# EAGLE design PWRBRD_2 (EAGLE 5.06)
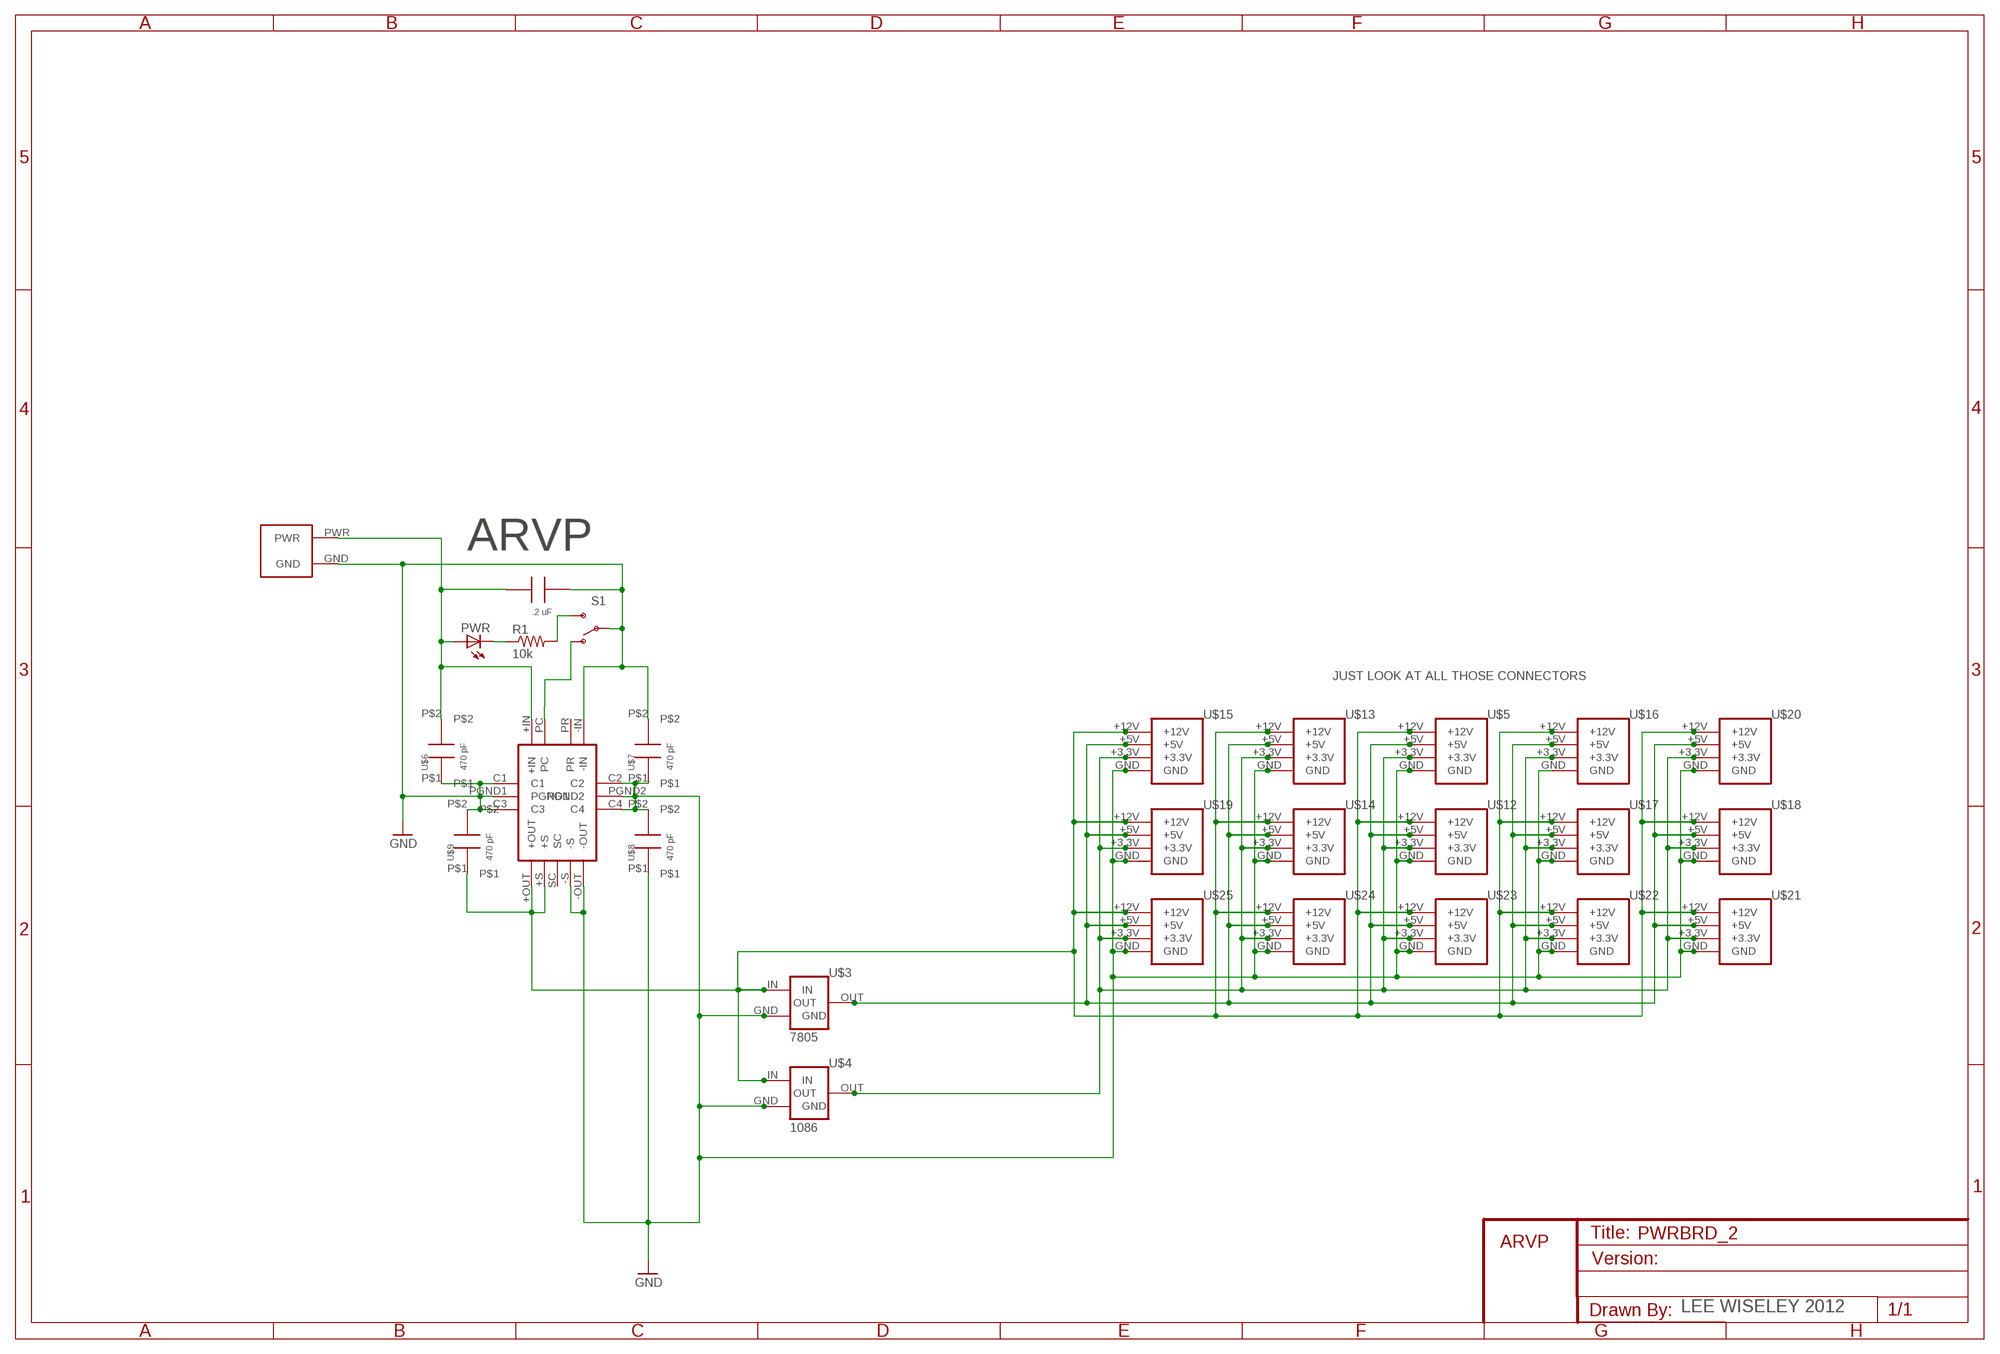
[diagram p0: schematic, sheet 1]

## Parts
BATTERY1  AND_PWR  [AND_PWR]
PWR  LED5MM  [LED5MM]
R1  10k  R-US_0207/7  [0207/7]
S1  SWITCH-SPSTPTH  [SWITCH-SPDT]
U$1  V24A12E400BG  [V24A12C400BL_VICOR_24_12_DC_STEPDOWN]
U$2  NAME  [NAME]
U$3  7805  [7805]
U$4  1086  [1086]
U$5  MINIFIT  [MINIFIT]
U$6  CS85_B2GA471KYS_470PF_CAP  [CS85-B2GA471KYS_470PF_CAP]
U$7  CS85_B2GA471KYS_470PF_CAP  [CS85-B2GA471KYS_470PF_CAP]
U$8  CS85_B2GA471KYS_470PF_CAP  [CS85-B2GA471KYS_470PF_CAP]
U$9  CS85_B2GA471KYS_470PF_CAP  [CS85-B2GA471KYS_470PF_CAP]
U$10  ECW-F4204JL_.2UF_CAP  [ECW-F4204JL_.2UF_CAP]
U$11  ARVP_LOGO  [ARVP]
U$12  MINIFIT  [MINIFIT]
U$13  MINIFIT  [MINIFIT]
U$14  MINIFIT  [MINIFIT]
U$15  MINIFIT  [MINIFIT]
U$16  MINIFIT  [MINIFIT]
U$17  MINIFIT  [MINIFIT]
U$18  MINIFIT  [MINIFIT]
U$19  MINIFIT  [MINIFIT]
U$20  MINIFIT  [MINIFIT]
U$21  MINIFIT  [MINIFIT]
U$22  MINIFIT  [MINIFIT]
U$23  MINIFIT  [MINIFIT]
U$24  MINIFIT  [MINIFIT]
U$25  MINIFIT  [MINIFIT]
U$26  BIG_ARVP  [BIG_ARVP]

## Nets
GND: BATTERY1.GND S1.2(P) U$1.-IN U$1.-OUT U$1.-S U$1.C1 U$1.C2 U$1.C3 U$1.C4 U$1.PGND1 U$1.PGND2 U$3.GND U$4.GND U$5.GND U$6.P$1 U$7.P$1 U$7.P$2 U$8.P$1 U$8.P$2 U$9.P$2 U$10.P$1 U$12.GND U$13.GND U$14.GND U$15.GND U$16.GND U$17.GND U$18.GND U$19.GND U$20.GND U$21.GND U$22.GND U$23.GND U$24.GND U$25.GND
N$1: U$4.OUT U$5.+3.3V U$12.+3.3V U$13.+3.3V U$14.+3.3V U$15.+3.3V U$16.+3.3V U$17.+3.3V U$18.+3.3V U$19.+3.3V U$20.+3.3V U$21.+3.3V U$22.+3.3V U$23.+3.3V U$24.+3.3V U$25.+3.3V
N$2: BATTERY1.PWR PWR.A U$1.+IN U$6.P$2 U$10.P$2
N$3: PWR.K(C) R1.1
N$4: S1.1(O) U$1.PC
N$5: R1.2 S1.3(S)
N$6: U$1.+OUT U$1.+S U$3.IN U$4.IN U$5.+12V U$9.P$1 U$12.+12V U$13.+12V U$14.+12V U$15.+12V U$16.+12V U$17.+12V U$18.+12V U$19.+12V U$20.+12V U$21.+12V U$22.+12V U$23.+12V U$24.+12V U$25.+12V
N$8: U$3.OUT U$5.+5V U$12.+5V U$13.+5V U$14.+5V U$15.+5V U$16.+5V U$17.+5V U$18.+5V U$19.+5V U$20.+5V U$21.+5V U$22.+5V U$23.+5V U$24.+5V U$25.+5V
Unconnected: U$1.PR U$1.SC

## Notes on the sheet
- JUST LOOK AT ALL THOSE CONNECTORS

## Library data of the parts
BATTERY1 = ARVP2:AND_PWR
PWR = SparkFun:LED: LEDs Standard schematic elements and footprints for 5mm, 3mm, 1206, and 0603 sized LEDs. 5mm - Spark Fun Electronics SKU : COM-00529 (and others)
R1 = rcl:R-US_: RESISTOR, American symbol
S1 = ARVP:SWITCH-SPST: SPST Switch Simple slide switch. Spark Fun Electronics SKU : COM-00102
U$1 = Kris:V24A12E400BG: VICOR Power V24A12E400BG 24-12 V DC-DC Switching Converter Converts a range of voltages around 24 V to 12 V with up to 400 W of output power.
U$2 = Kris:NAME
U$3 = Kris:7805
U$4 = Kris:1086
U$5 U$12-U$25 = Kris:MINIFIT: Molex Minifit Connector Versatile 4-contact power connector.
U$6-U$9 = Kris:CS85_B2GA471KYS_470PF_CAP
U$10 = Kris:ECW-F4204JL_.2UF_CAP: PANASONIC ECW-F4204JL .2uF Capacitor
U$11 = ARVP2:ARVP_LOGO
U$26 = Kris:BIG_ARVP

## Board
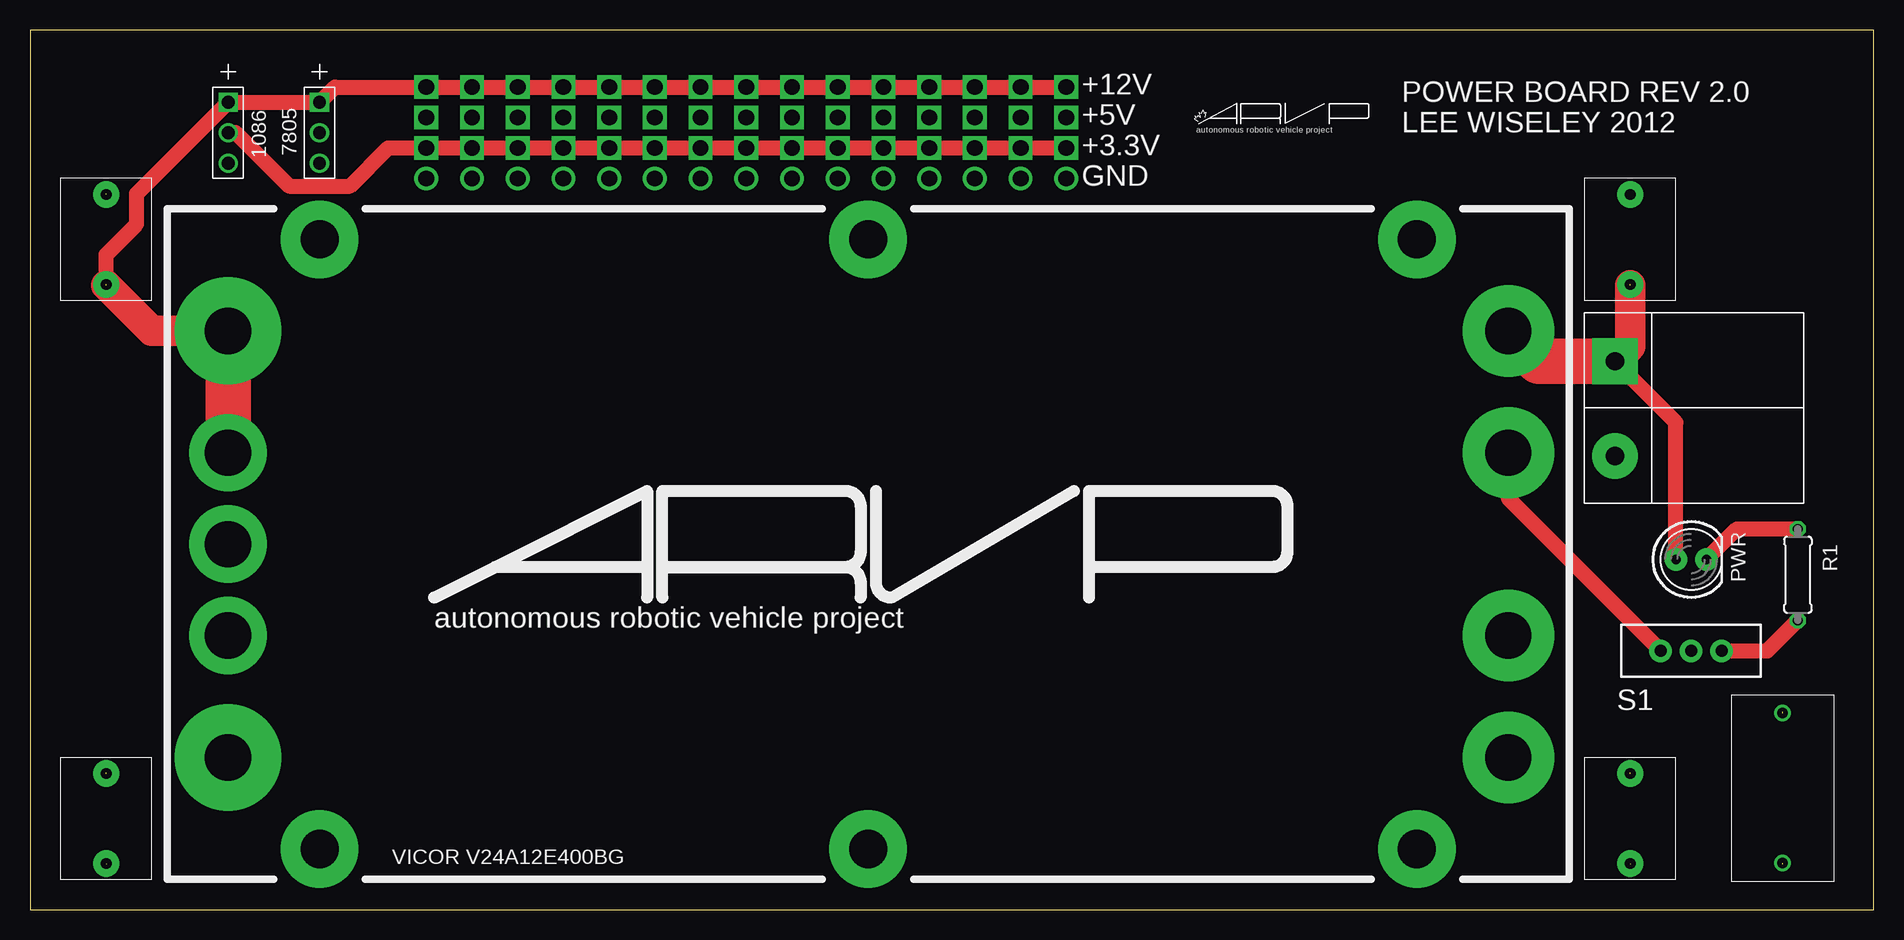
[diagram p1: board, top side]
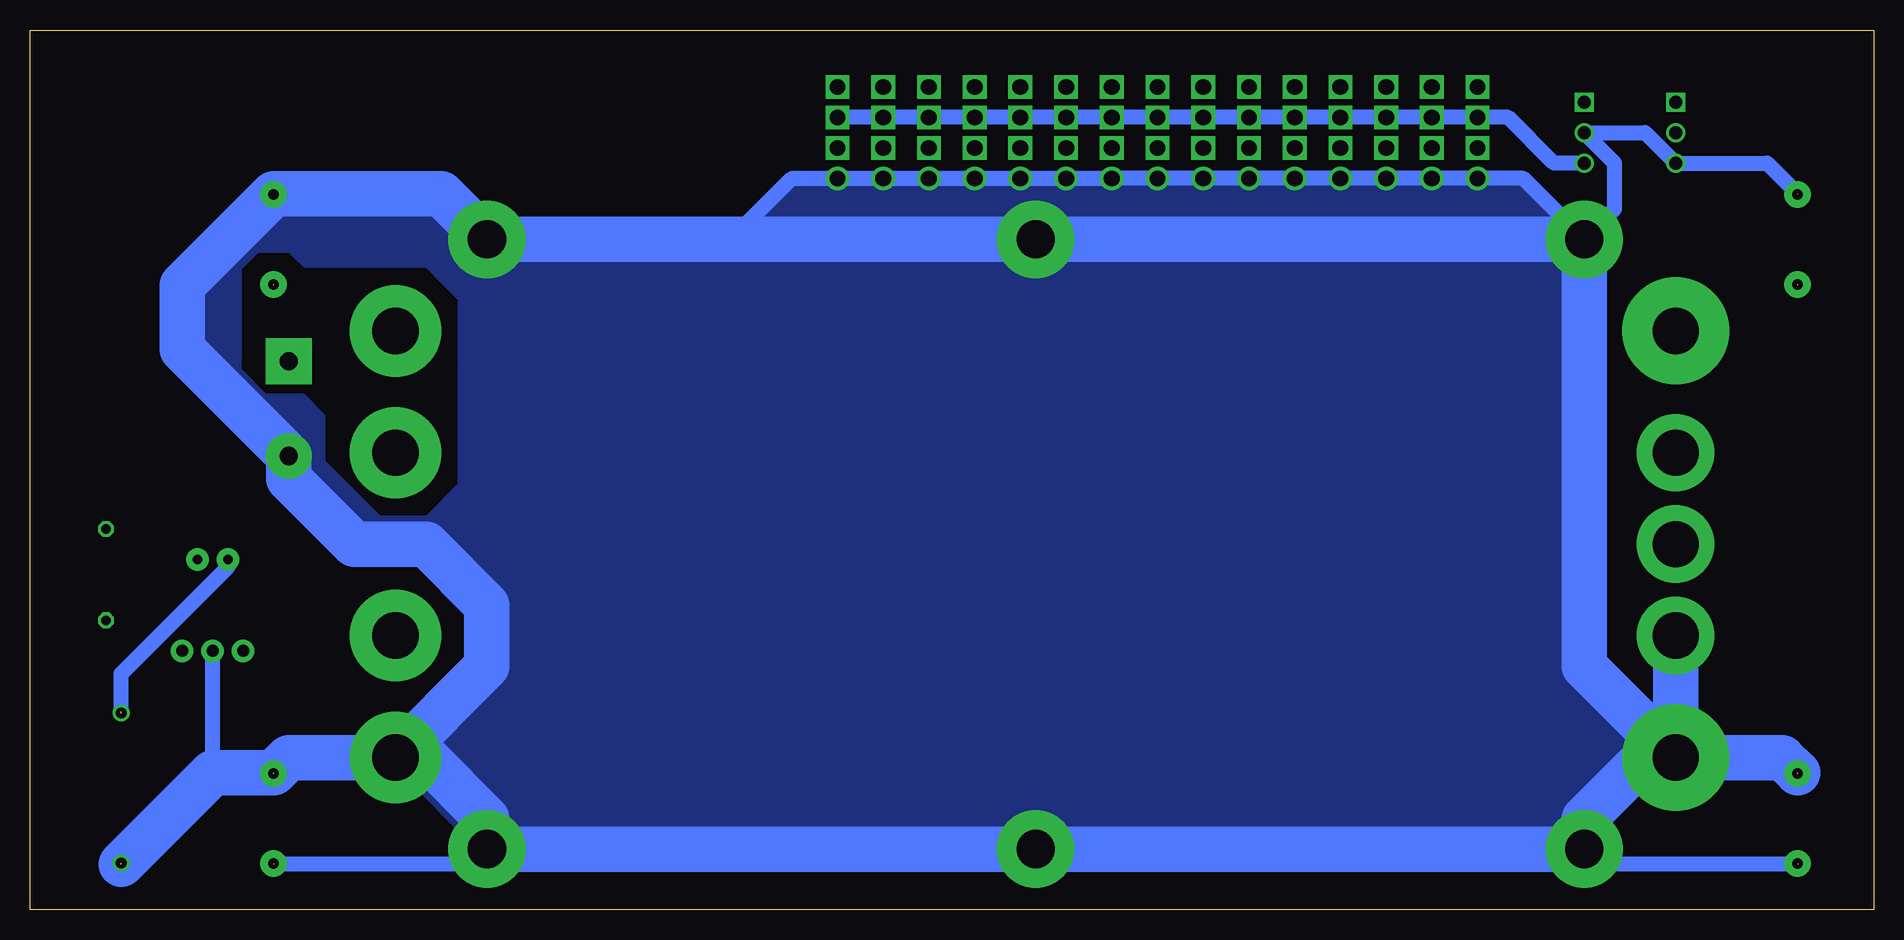
[diagram p2: board, bottom side, seen from below]

Size 153.65 x 73.33 mm. Coordinates in mm from the lower left corner, seen from the top.
Outline: 0,0 153.65,0 153.65,73.33 0,73.33 0,0
Copper layers (1*16): Top 0.035mm / dielectric 1.5mm / Bottom 0.035mm
Design rules "default": minimum track width 10mil, minimum drill 24mil, track to track 8mil, track to pad 8mil, pad to pad 8mil, via to via 8mil, smd to smd 8mil, copper to edge 40mil, drill to drill 8mil, minimum pad ring 10mil, minimum via ring 8mil, stop-mask expansion 4mil, vias tented up to drill 0mil, thermal gap 10mil
bRestrict: 19 lines

### Footprints (pad centres in the part's own frame; a part is rotated, then mirrored left to right if it is on the bottom)
AND_PWR = drill 1.524 pad 3.81 round: GND 0,-7.886 | drill 1.524 pad 3.81 square: PWR 0,0
LED5MM = drill 0.813 pad 1.88 round: A -1.27,0; K 1.27,0
0207/7 = drill 0.813 octagon: 1 -3.81,0; 2 3.81,0
SWITCH-SPDT = drill 1.016 pad 1.88 round: 1 0,2.54; 2 0,0; 3 0,-2.54
V24A12C400BL_VICOR_24_12_DC_STEPDOWN = drill 3.861 pad 7.62 round: +IN 17.78,53.34; -IN -17.78,53.34; PC 7.62,53.34; PR -7.62,53.34 | drill 3.861 pad 8.89 round: +OUT 17.78,-53.34; -OUT -17.78,-53.34 | drill 3.861 pad 6.452 round: +S 7.62,-53.34; -S -7.62,-53.34; SC 0,-53.34 | drill 3.175 pad 6.452 round: C1 25.4,45.72; C2 -25.4,45.72; C3 25.4,-45.72; C4 -25.4,-45.72; PGND1 25.4,0; PGND2 -25.4,0
7805 = drill 1.067 round: GND 0,0; OUT 0,-2.54 | drill 1.067 square: IN 0,2.54
1086 = drill 1.067 round: GND 0,2.54; OUT 0,0 | drill 1.067 square: IN 0,-2.54
MINIFIT = drill 1.321 square: +3.3V 0,2.54; +5V 0,5.08; +12V 0,7.62 | drill 1.321 round: GND 0,0
CS85-B2GA471KYS_470PF_CAP = drill 0.889 pad 2.184 round: P$1 0,-3.75; P$2 0,3.75
ECW-F4204JL_.2UF_CAP = drill 0.889 round: P$1 -6.25,0; P$2 6.25,0

### Placement (x,y rotation side)
BATTERY1  132.08,45.72 0 top
PWR  138.43,29.21 0 top
R1  147.32,27.94 270 top
S1  138.43,21.59 90 top
U$1  69.85,30.48 90 bottom
U$2  114.3,64.77 0 top
U$3  24.13,64.77 0 top
U$4  16.51,64.77 180 top
U$5  86.36,60.96 0 top
U$6  133.35,55.88 180 top
U$7  133.35,7.62 0 top
U$8  6.35,7.62 0 top
U$9  6.35,55.88 0 top
U$10  146.05,10.16 90 top
U$11  97.16,64.77 0 top
U$12  82.55,60.96 0 top
U$13  78.74,60.96 0 top
U$14  74.93,60.96 0 top
U$15  71.12,60.96 0 top
U$16  67.31,60.96 0 top
U$17  63.5,60.96 0 top
U$18  59.69,60.96 0 top
U$19  55.88,60.96 0 top
U$20  52.07,60.96 0 top
U$21  48.26,60.96 0 top
U$22  44.45,60.96 0 top
U$23  40.64,60.96 0 top
U$24  36.83,60.96 0 top
U$25  33.02,60.96 0 top
U$26  33.66,26.04 0 top

### Tracks (layer width: path | path; a pad name or v marks a point on that pad's centre or on a via)
GND  (6 unrouted)
  Bottom 1.27: 6.35,59.69 8.89,62.23 U$4.GND 19.05,64.77 U$3.GND 21.59,62.23 21.59,58.42 U$1.C3 29.21,60.96 U$25.GND U$24.GND U$23.GND U$22.GND U$21.GND U$20.GND U$19.GND U$18.GND U$17.GND U$16.GND U$15.GND U$14.GND U$13.GND U$12.GND U$5.GND 90.17,60.96 95.25,55.88 | 133.35,3.81 116.84,3.81 U$1.C2 | 138.43,11.43 S1.2 | 6.35,3.81 22.86,3.81 U$1.C4
  Bottom 3.81: U$1.-OUT 19.05,12.7 24.13,7.62 U$1.C4 U$1.C2 115.57,7.62 120.65,12.7 U$1.-IN | U$1.-IN 132.08,12.7 133.35,11.43 138.43,11.43 146.05,3.81 | U$1.-IN 115.57,20.32 115.57,25.4 120.65,30.48 126.62,30.48 132.08,35.94 132.08,37.85 140.97,46.74 140.97,52.07 133.35,59.69 119.38,59.69 U$1.C1 95.25,55.88 U$1.PGND1 U$1.C3 24.13,20.32 U$1.-OUT | U$1.-OUT U$1.-S | 6.35,11.43 7.62,12.7 U$1.-OUT
  pour Bottom (no thermals): 17.78,13.97 24.13,20.32 24.13,55.88 29.21,60.96 90.17,60.96 95.25,55.88 115.57,55.88 119.38,59.69 133.35,59.69 140.97,52.07 140.97,46.99 124.46,30.48 120.65,30.48 115.57,25.4 115.57,20.32 123.19,12.7 115.57,5.08 26.67,5.08
N$1
  Top 1.27: U$4.OUT 17.14,64.77 21.59,60.33 26.67,60.33 29.84,63.5 30.48,63.5 U$25.+3.3V U$24.+3.3V U$23.+3.3V U$22.+3.3V U$21.+3.3V U$20.+3.3V U$19.+3.3V U$18.+3.3V U$17.+3.3V U$16.+3.3V U$15.+3.3V U$14.+3.3V U$13.+3.3V U$12.+3.3V U$5.+3.3V
N$2  (2 unrouted)
  Top 1.27: BATTERY1.PWR 137.16,40.64 PWR.A
  Top 2.54: BATTERY1.PWR 133.35,46.99 133.35,52.07
  Top 3.81: BATTERY1.PWR 125.73,45.72 U$1.+IN
  Bottom 1.27: PWR.A 137.16,28.57 146.05,19.68 146.05,16.51
N$3
  Top 1.27: PWR.K 142.24,31.75 R1.1
N$4
  Top 1.27: S1.1 123.19,34.29 U$1.PC
N$5
  Top 1.27: R1.2 144.78,21.59 S1.3
N$6  (1 unrouted)
  Top 1.27: U$5.+12V U$12.+12V U$13.+12V U$14.+12V U$15.+12V U$16.+12V U$17.+12V U$18.+12V U$19.+12V U$20.+12V U$21.+12V U$22.+12V U$23.+12V U$24.+12V U$25.+12V 25.4,68.58 U$3.IN U$4.IN 8.89,59.69 8.89,57.15 6.35,54.61 6.35,52.07
  Top 2.54: U$1.+OUT 10.16,48.26 6.35,52.07
  Top 3.81: U$1.+S U$1.+OUT
N$8
  Bottom 1.27: U$3.OUT 26.67,62.23 30.48,66.04 U$25.+5V U$24.+5V U$23.+5V U$22.+5V U$21.+5V U$20.+5V U$19.+5V U$18.+5V U$17.+5V U$16.+5V U$15.+5V U$14.+5V U$13.+5V U$12.+5V U$5.+5V

### Text on the board
tPlace: +12V | POWER BOARD REV 2.0 | +5V | +3.3V | GND